# Altium schematic sheet Power.SchDoc
size A4
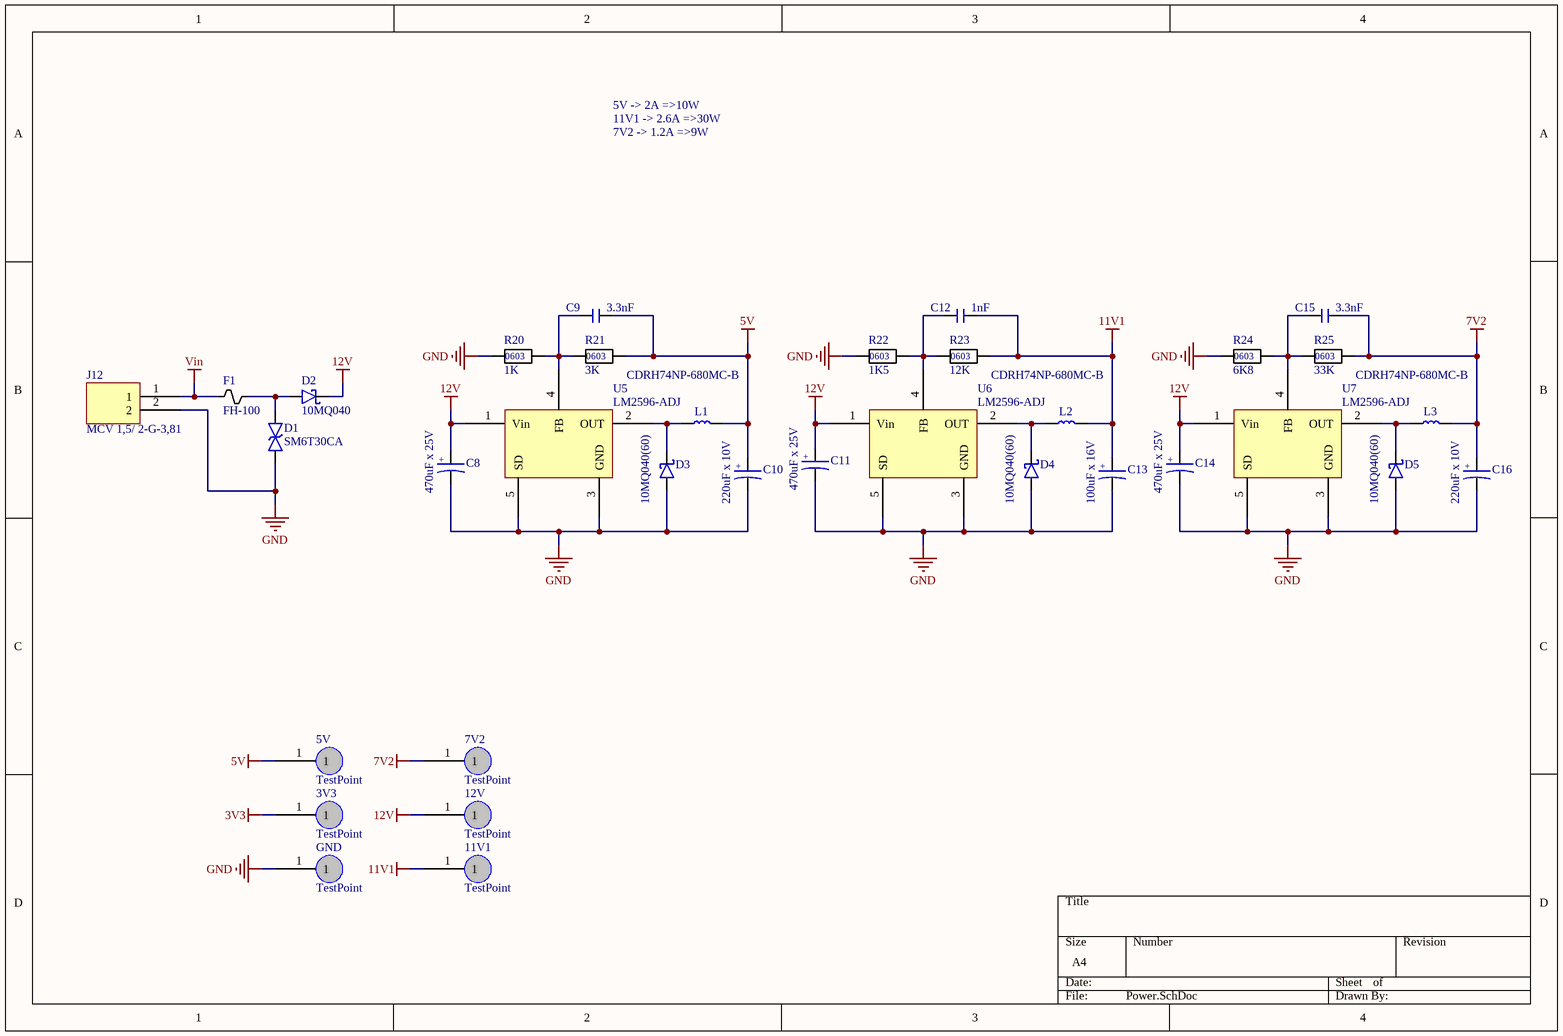
[diagram p0: Power.SchDoc]

## Parts
3V3  TestPoint  [TestPoint]
5V  TestPoint  [TestPoint]
7V2  TestPoint  [TestPoint]
11V1  TestPoint  [TestPoint]
12V  TestPoint  [TestPoint]
C8  470uF x 25V  [ALCAP_8x16]
C9  3.3nF  [CHIP_C_0603]
C10  220uF x 10V  [Tantal - D]
C11  470uF x 25V  [ALCAP_8x16]
C12  1nF  [CHIP_C_0603]
C13  100uF x 16V  [Tantal - B]
C14  470uF x 25V  [ALCAP_8x16]
C15  3.3nF  [CHIP_C_0603]
C16  220uF x 10V  [Tantal - D]
D1  SM6T30CA  [DO-214AA]
D2  10MQ040  [DO214-AC]
D3  10MQ040(60)  [DO214-AC]
D4  10MQ040(60)  [DO214-AC]
D5  10MQ040(60)  [DO214-AC]
F1  FH-100  [FH-100]
GND  TestPoint  [TestPoint]
J12  MCV 1,5/ 2-G-3,81  [CON_2_5.08]
L1  CDRH74NP-680MC-B  [CDRH74]
L2  CDRH74NP-680MC-B  [CDRH74]
L3  CDRH74NP-680MC-B  [CDRH74]
R20  1K  [CHIP_R_0603]
R21  3K  [CHIP_R_0603]
R22  1K5  [CHIP_R_0603]
R23  12K  [CHIP_R_0603]
R24  6K8  [CHIP_R_0603]
R25  33K  [CHIP_R_0603]
U5  LM2596-ADJ  [TO-220-5]
U6  LM2596-ADJ  [TO-220-5]
U7  LM2596-ADJ  [TO-220-5]

## Nets
3V3: 3V3.1
5V: 5V.1 C9.1 C10.1 L1.2 R21.2
7V2: 7V2.1 C15.1 C16.1 L3.2 R25.2
11V1: 11V1.1 C12.1 C13.1 L2.2 R23.2
12V: 12V.1 C8.1 C11.1 C14.1 D2.2 U5.1(Vin) U6.1(Vin) U7.1(Vin)
GND: C8.2 C10.2 C11.2 C13.2 C14.2 C16.2 D1.2 D3.1 D4.1 D5.1 GND.1 J12.2 R20.1 R22.1 R24.1 U5.3(GND) U5.5(SD) U6.3(GND) U6.5(SD) U7.3(GND) U7.5(SD)
Vin: F1.1 J12.1
NetC9_2: C9.2 R20.2 R21.1 U5.4(FB)
NetC12_2: C12.2 R22.2 R23.1 U6.4(FB)
NetC15_2: C15.2 R24.2 R25.1 U7.4(FB)
NetD1_1: D1.1 D2.1 F1.2
NetD3_2: D3.2 L1.1 U5.2(OUT)
NetD4_2: D4.2 L2.1 U6.2(OUT)
NetD5_2: D5.2 L3.1 U7.2(OUT)

## Notes on the sheet
- 5V -> 2A =>10W
- 11V1 -> 2.6A =>30W
- 7V2 -> 1.2A =>9W
- (in symbol Electrolit) +
- (in symbol RES_0603) 0603
- (in symbol Tantal) +

## Library data of the parts
C8 C11 C14 = Electrolit
C9 C12 C15 = CHIP_C
C10 C13 C16 = Tantal
D1 = SM6T27CA: ESD protection
D2-D5 = 10MQ040: Rectifier diode
F1 = FuseGlass 5x20
L1-L3 = CDRH74
R20-R25 = RES_0603
U5-U7 = LM2596 (5 pin)